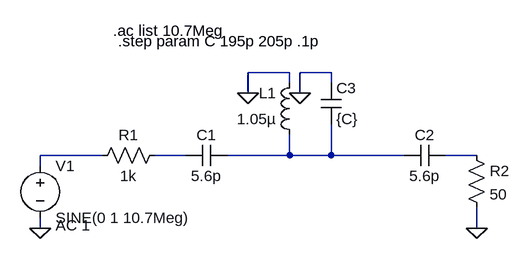
[diagram p0: schematic 10mhz-filter.asc]
10mhz-filter.asc, the LTspice schematic file:
Version 4
SHEET 1 880 680
WIRE 160 96 96 96
WIRE 224 96 176 96
WIRE 160 112 160 96
WIRE 224 112 224 96
WIRE 96 128 96 96
WIRE 176 128 176 96
WIRE -128 224 -224 224
WIRE 0 224 -48 224
WIRE 160 224 160 192
WIRE 160 224 64 224
WIRE 224 224 224 176
WIRE 224 224 160 224
WIRE 336 224 224 224
WIRE 448 224 400 224
WIRE -224 240 -224 224
WIRE -224 336 -224 320
WIRE 448 336 448 304
FLAG 96 128 0
FLAG 176 128 0
FLAG -224 336 0
FLAG 448 336 0
SYMBOL res -32 208 R90
WINDOW 0 0 56 VBottom 2
WINDOW 3 32 56 VTop 2
SYMATTR InstName R1
SYMATTR Value 1k
SYMBOL cap 64 208 R90
WINDOW 0 0 32 VBottom 2
WINDOW 3 32 32 VTop 2
SYMATTR InstName C1
SYMATTR Value 5.6p
SYMBOL cap 400 208 R90
WINDOW 0 0 32 VBottom 2
WINDOW 3 32 32 VTop 2
SYMATTR InstName C2
SYMATTR Value 5.6p
SYMBOL ind 176 208 R180
WINDOW 0 36 80 Left 2
WINDOW 3 36 40 Left 2
SYMATTR InstName L1
SYMATTR Value 1.05µ
SYMBOL cap 208 112 R0
SYMATTR InstName C3
SYMATTR Value {C}
SYMBOL voltage -224 224 R0
WINDOW 123 24 108 Left 2
WINDOW 39 0 0 Left 0
SYMATTR Value2 AC 1
SYMATTR InstName V1
SYMATTR Value SINE(0 1 10.7Meg)
SYMBOL res 432 208 R0
SYMATTR InstName R2
SYMATTR Value 50
TEXT -112 32 Left 2 !.ac list 10.7Meg
TEXT -104 48 Left 2 !.step param C 195p 205p .1p

The netlist it stands for:
* 10mhz-filter.asc
R1 N002 N001 1k
C1 N003 N002 5.6p
C2 N004 N003 5.6p
L1 N003 0 1.05µ
C3 0 N003 {C}
V1 N001 0 SINE(0 1 10.7Meg) AC 1
R2 N004 0 50
.ac list 10.7Meg
.step param C 195p 205p .1p
.backanno
.end